# Altium project Merge Board.PrjPCB
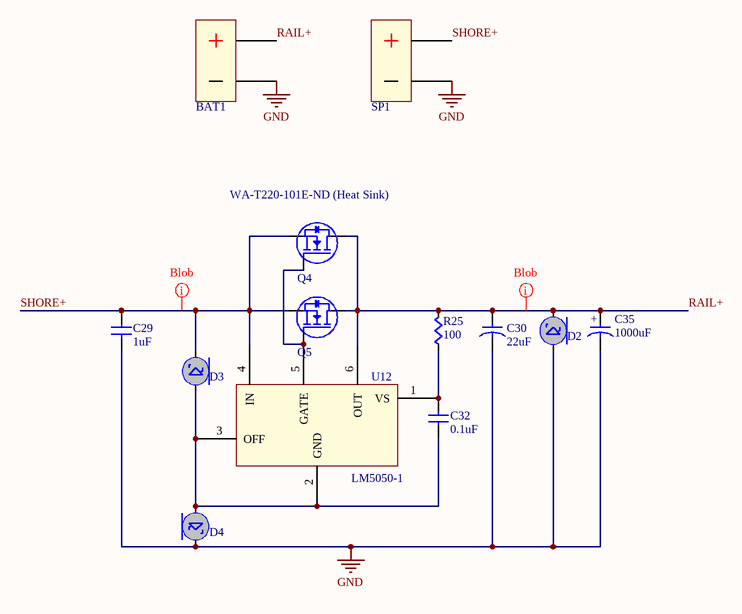
[diagram p0: Rail Station.SchDoc]
5 sheets, 115 parts. Net scope: global (net labels, ports and power ports of the same name join across sheets).
Board files: MergeBoard.PcbDoc, MergeBoard2.PcbDoc, MergeBoard3.PcbDoc, MergeBoard4.PcbDoc
Sheets:
  Rail Station.SchDoc
  PowerSplitter.SchDoc
  Power.SchDoc
  Attachments.SchDoc
  CPU.SchDoc

## Sheet Rail Station.SchDoc
size A

### Parts
BAT1  BATWIRE  [BATWIRE12]  (value not drawn)
C29  value 1uF  [CAPC0603]  (hidden comment: Cap)
C30  value 22uF  [CAP22uF100V]  (hidden comment: CapPol)
C32  value 0.1uF  [CAPC0603]  (hidden comment: Cap)
C35  value 1000uF  [CAP1000uF]  (hidden comment: CapPol)
D2  SMBJ60A-13-F  [SMBJ60A-13-F]  (value not drawn)
D3  SS16T3G  [SS16T3G]  (value not drawn)
D4  SS16T3G  [SS16T3G]  (value not drawn)
Q4  IRFB3306PbF  [TO-220AB Heatsink Vertical]  (value not drawn)
Q5  IRFB3306PbF  [TO-220AB Heatsink Vertical]  (value not drawn)
R25  value 100  [RES0603]  (hidden comment: Res)
SP1  BATWIRE  [BATWIRE12]  (value not drawn)
U12  LM5050-1  [LM5050]

### Nets
GND: BAT1.- C29.2(B) C30.2(B) C35.2(B) D2.A D4.C SP1.-
RAIL+: BAT1.+ C30.1(A) C35.1(A) D2.C Q4.D Q5.D R25.1(A) U12.6(OUT)
SHORE+: C29.1(A) D3.C Q4.S Q5.S SP1.+ U12.4(IN)
NetC32_1: C32.1(A) R25.2(B) U12.1(VS)
NetC32_2: C32.2(B) D3.A D4.A U12.2(GND) U12.3(OFF)
NetQ4_G: Q4.G Q5.G U12.5(GATE)

### Layout directives
net class Blob: RAIL+, SHORE+

### Notes on the sheet
- (near Q4) WA-T220-101E-ND (Heat Sink)
- (in symbol CapPol) +

### Library data of the parts
BAT1 SP1 = BATWIRE: Two large gauge leads soldered directly to the board.
D2 = SMBJ60A-13-F: TVS UNIDIRECT 600W 60V SMB; Supplier 1: Digi-Key; Supplier Part Number 1: SMBJ60A-FDIDKR-ND
D3 D4 = SS16T3G: DIODE SCHOTTKY 60V 1A SMA; Supplier 1: Digi-Key; Supplier Part Number 1: SS16T3GOSDKR-ND
Q4 Q5 = IRFx3306PbF: HEXFET Power MOSFET; Heatsink: A10755-ND; Supplier 1: Digi-Key; Supplier Part Number 1: IRFB3306PBF-ND
U12 = LM5050: High-Side OR-ing FET Controller; Supplier 1: Digi-Key; Supplier Part Number 1: LM5050MK-1/NOPBCT-ND
C29 C32 = Cap: Supplier 1: Digi-Key
  C29: Supplier Part Number 1: 1276-1860-1-ND
  C32: Supplier Part Number 1: 445-6938-1-ND
C30 C35 = CapPol: Supplier 1: Digi-Key
  C30: Supplier Part Number 1: P5310-ND
  C35: Supplier Part Number 1: 565-1618-ND
R25 = Res: Supplier 1: Digi-Key; Supplier Part Number 1: RMCF0603FT100RCT-ND

## Sheet PowerSplitter.SchDoc
size A
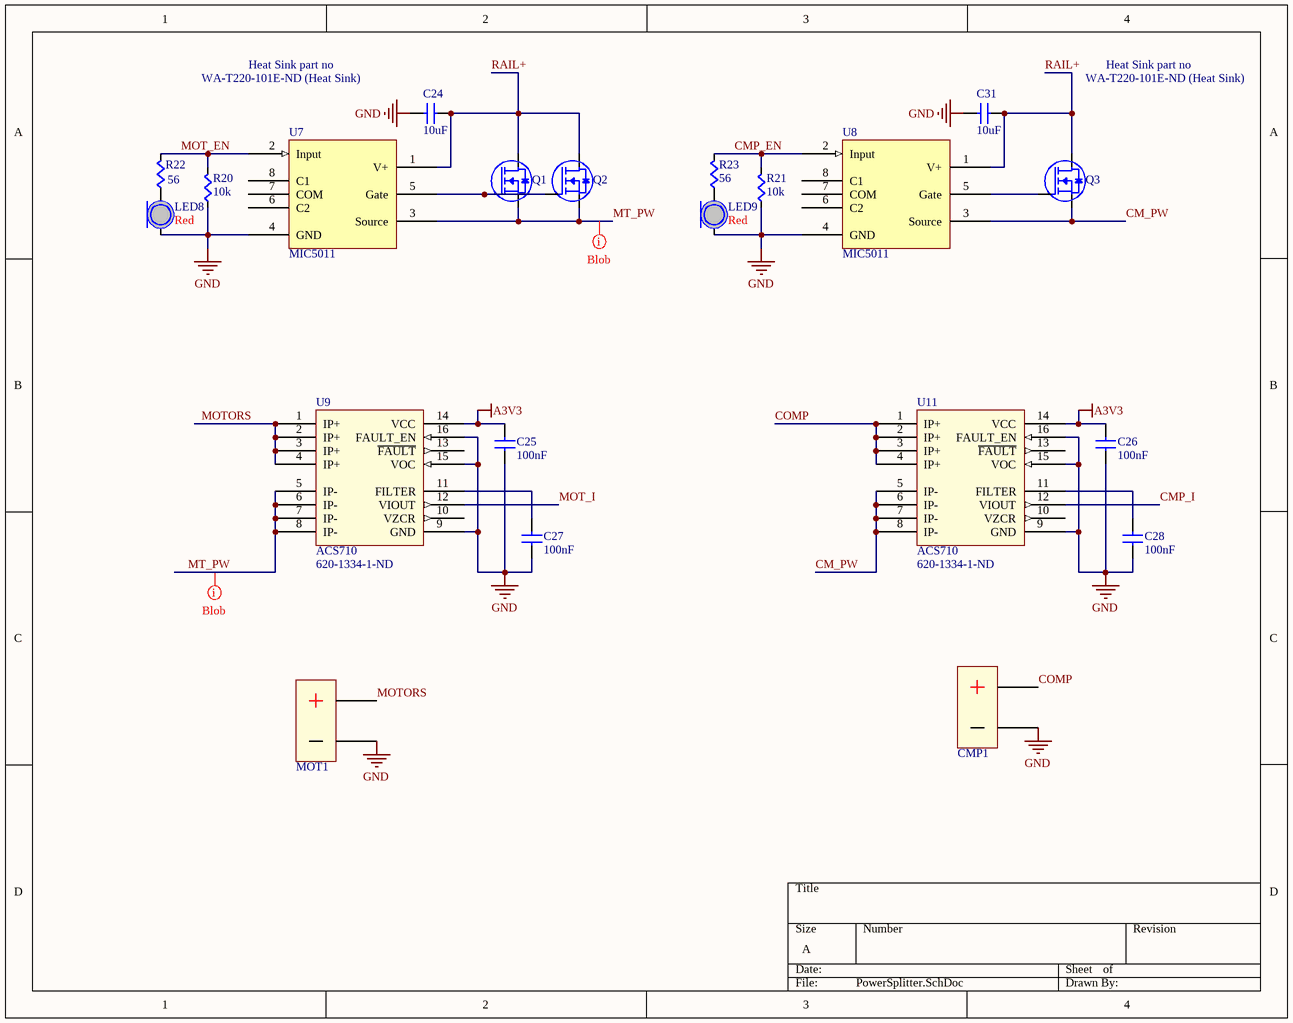
[diagram p1: PowerSplitter.SchDoc]

### Parts
C24  value 10uF  [CAPC1206]  (hidden comment: Cap)
C25  value 100nF  [CAPC0603]  (hidden comment: Cap)
C26  value 100nF  [CAPC0603]  (hidden comment: Cap)
C27  value 100nF  [CAPC0603]  (hidden comment: Cap)
C28  value 100nF  [CAPC0603]  (hidden comment: Cap)
C31  value 10uF  [CAPC1206]  (hidden comment: Cap)
CMP1  BATWIRE  [BATWIRE12]  (value not drawn)
LED8  Color: Red  [LED0805]  (hidden comment: LED)
LED9  Color: Red  [LED0805]  (hidden comment: LED)
MOT1  BATWIRE  [BATWIRE12]  (value not drawn)
Q1  IRFB3306PbF  [TO-220AB Heatsink Vertical]  (value not drawn)
Q2  IRFB3306PbF  [TO-220AB Heatsink Vertical]  (value not drawn)
Q3  IRFB3306PbF  [TO-220AB Heatsink Vertical]  (value not drawn)
R20  value 10k  [RES0603]  (hidden comment: Res)
R21  value 10k  [RES0603]  (hidden comment: Res)
R22  value 56  [RES0603]  (hidden comment: Res)
R23  value 56  [RES0603]  (hidden comment: Res)
U7  MIC5011  [MIC5011]
U8  MIC5011  [MIC5011]
U9  ACS710  Supplier Part Number 1: 620-1334-1-ND  [ACS710]
U11  ACS710  Supplier Part Number 1: 620-1334-1-ND  [ACS710]

### Nets
A3V3: C25.1(A) C26.1(A) U9.14(VCC) U11.14(VCC)
GND: C24.1(A) C25.2(B) C26.2(B) C27.2(B) C28.2(B) C31.1(A) CMP1.- LED8.C LED9.C MOT1.- R20.2(B) R21.2(B) U7.4(GND) U8.4(GND) U9.9(GND) U9.15(VOC) U9.16(FAULT_EN) U11.9(GND) U11.15(VOC) U11.16(FAULT_EN)
CM_PW: Q3.S U8.3(Source) U11.5(IP-) U11.6(IP-) U11.7(IP-) U11.8(IP-)
CMP_EN: R21.1(A) R23.1(A) U8.2(Input)
CMP_I: U11.12(VIOUT)
COMP: CMP1.+ U11.1(IP+) U11.2(IP+) U11.3(IP+) U11.4(IP+)
MOT_EN: R20.1(A) R22.1(A) U7.2(Input)
MOT_I: U9.12(VIOUT)
MOTORS: MOT1.+ U9.1(IP+) U9.2(IP+) U9.3(IP+) U9.4(IP+)
MT_PW: Q1.S Q2.S U7.3(Source) U9.5(IP-) U9.6(IP-) U9.7(IP-) U9.8(IP-)
RAIL+: C24.2(B) C31.2(B) Q1.D Q2.D Q3.D U7.1(V+) U8.1(V+)
NetC27_1: C27.1(A) U9.11(FILTER)
NetC28_1: C28.1(A) U11.11(FILTER)
NetLED8_A: LED8.A R22.2(B)
NetLED9_A: LED9.A R23.2(B)
NetQ1_G: Q1.G Q2.G U7.5(Gate)
NetQ3_G: Q3.G U8.5(Gate)

Not connected (* = marked no-connect by the designer): U7 6(C2) 7(COM) 8(C1); U8 6(C2) 7(COM) 8(C1); U9 10(VZCR) 13(~{FAULT}); U11 10(VZCR) 13(~{FAULT})

### Layout directives
net class Blob: MT_PW

### Notes on the sheet
- WA-T220-101E-ND (Heat Sink)
- Heat Sink part no

### Library data of the parts
CMP1 MOT1 = BATWIRE: as BAT1 on sheet Rail Station
Q1-Q3 = IRFx3306PbF: HEXFET Power MOSFET; Heatsink: A10755-ND; Supplier 1: Digi-Key; Supplier Part Number 1: IRFB3306PBF-ND
U7 U8 = MIC5011: Minimum Parts High- or Low-Side MOSFET Driver; Supplier 1: Digi-Key; Supplier Part Number 1: 576-1230-ND
U9 U11 = ACS710: Current Sensor with Integrated Overcurrent Detection; Supplier 1: Digi-Key
C24-C28 C31 = Cap: Supplier 1: Digi-Key
  C24 C31: Supplier Part Number 1: 1276-2876-1-ND
  C25-C28: Supplier Part Number 1: 1276-1000-1-ND
LED8 LED9 = LED: Supplier 1: Digi-Key; Supplier Part Number 1: 754-1133-1-ND
R20-R23 = Res: Supplier 1: Digi-Key
  R20 R21: Supplier Part Number 1: RMCF0603JT10K0CT-ND
  R22 R23: Supplier Part Number 1: RMCF0603JT56R0CT-ND

## Sheet Power.SchDoc
size A
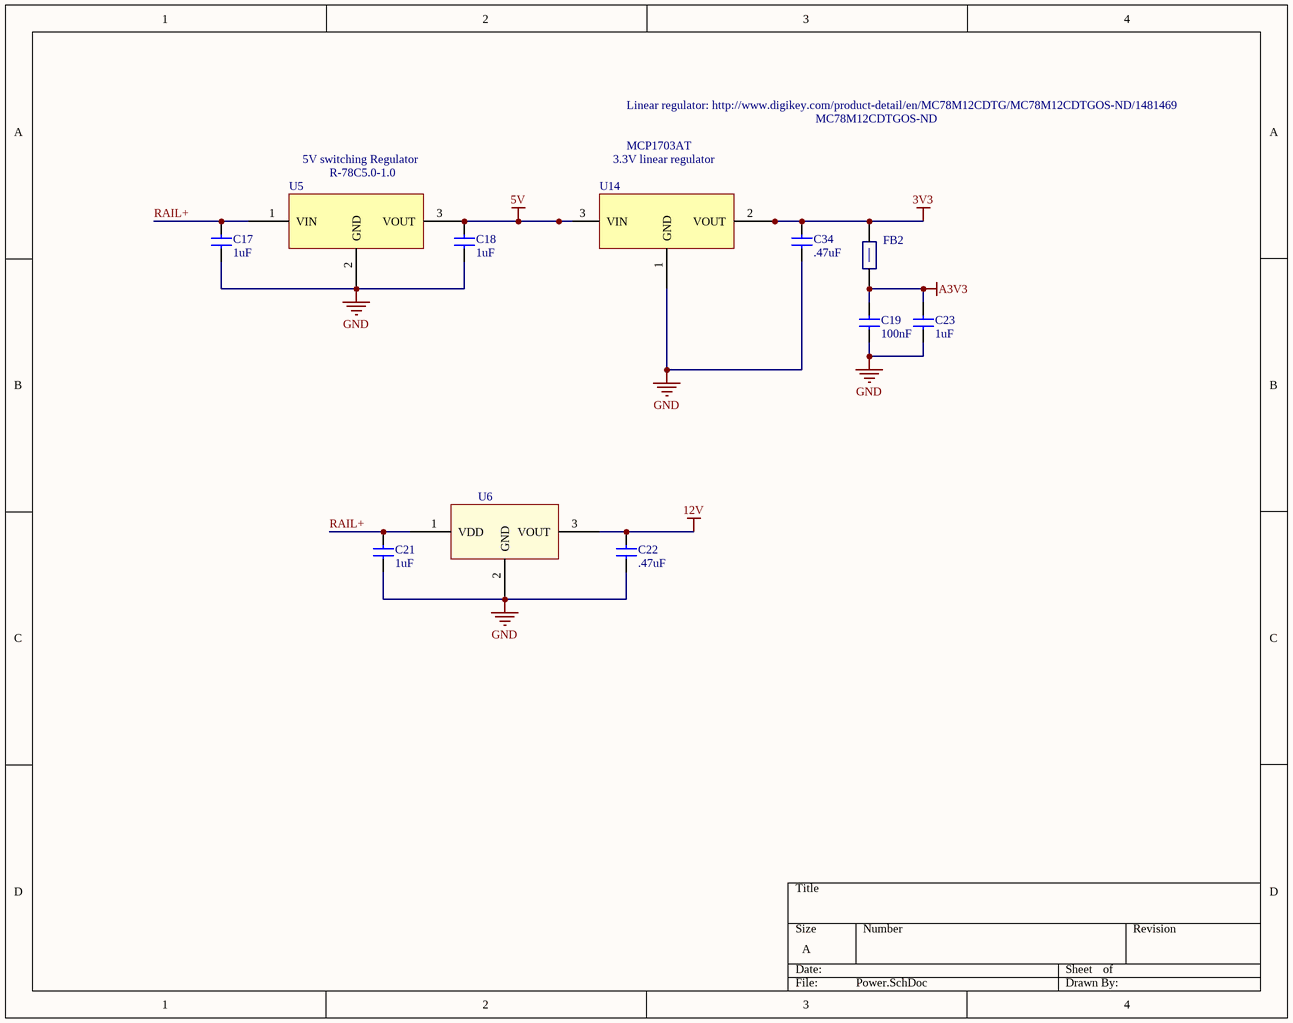
[diagram p2: Power.SchDoc]

### Parts
C17  value 1uF  [CAPC0603]  (hidden comment: Cap)
C18  value 1uF  [CAPC0603]  (hidden comment: Cap)
C19  value 100nF  [CAPC0603]  (hidden comment: Cap)
C21  value 1uF  [CAPC0603]  (hidden comment: Cap)
C22  value .47uF  [CAPC0603]  (hidden comment: Cap)
C23  value 1uF  [CAPC0603]  (hidden comment: Cap)
C34  value .47uF  [CAPC0603]  (hidden comment: Cap)
FB2  FBead  [RES0603]  (value not drawn)
U5  R-78C5.0-1.0  [R-78C5.0-1.0]
U6  MC78M12CDTG  [MC78M12CDTG]  (value not drawn)
U14  MCP1703AT  [MCP1703AT-xx02EMB]

### Nets
3V3: C34.1(A) FB2.2(B) U14.2(VOUT)
5V: C18.1(A) U5.3(VOUT) U14.3(VIN)
12V: C22.1(A) U6.3(VOUT)
A3V3: C19.1(A) C23.1(A) FB2.1(A)
GND: C17.2(B) C18.2(B) C19.2(B) C21.2(B) C22.2(B) C23.2(B) C34.2(B) U5.2(GND) U6.2(GND) U14.1(GND)
RAIL+: C17.1(A) C21.1(A) U5.1(VIN) U6.1(VDD)

### Notes on the sheet
- 5V switching Regulator
- 3.3V linear regulator
- Linear regulator: http://www.digikey.com/product-detail/en/MC78M12CDTG/MC78M12CDTGOS-ND/1481469
- MC78M12CDTGOS-ND

### Library data of the parts
FB2 = FBead: Ferrite Bead; Supplier 1: Digi-Key; Supplier Part Number 1: 445-2988-1-ND
U5 = R-78C5.0-1.0: CONV DC/DC 1A 5V OUT SIP VERT; Supplier 1: Digi-Key; Supplier Part Number 1: 945-1395-5-ND
U6 = MC78M12CDTG: IC REG LDO 12V 0.5A DPAK; Supplier 1: Digi-Key; Supplier Part Number 1: MC78M12CDTGOS-ND
U14 = MCP1703AT: 250 mA, 16V, Low Quiescent Current LDO Regulator; pin to pad: 2>3 3>2; Supplier 1: Digi-Key; Supplier Part Number 1: MCP1703AT-3302E/CBCT-ND
C17-C19 C21-C23 C34 = Cap: Supplier 1: Digi-Key
  C17 C18 C21 C23: Supplier Part Number 1: 1276-1860-1-ND
  C19: Supplier Part Number 1: 1276-1000-1-ND
  C22 C34: Supplier Part Number 1: 445-7465-1-ND

## Sheet Attachments.SchDoc
size A
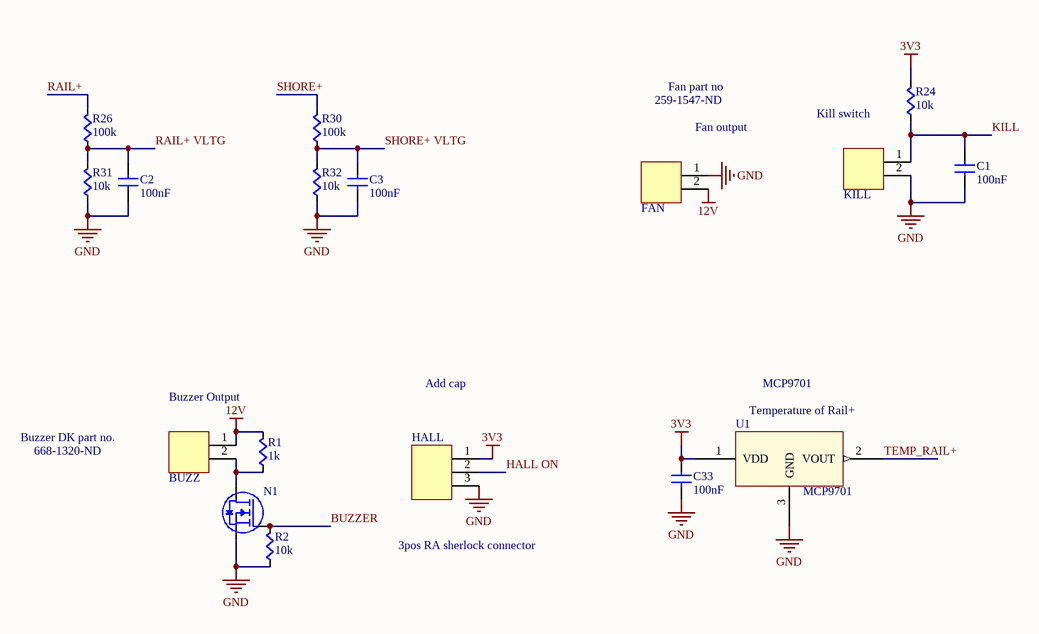
[diagram p3: Attachments.SchDoc]

### Parts
BUZZ  2-pin Horz Sherlock  [MOLEX-HDR-1X2-SHERLOCK-HORZ]  (value not drawn)
C1  value 100nF  [CAPC0603]  (hidden comment: Cap)
C2  value 100nF  [CAPC0603]  (hidden comment: Cap)
C3  value 100nF  [CAPC0603]  (hidden comment: Cap)
C33  value 100nF  [CAPC0603]  (hidden comment: Cap)
FAN  2-pin Horz Sherlock  [MOLEX-HDR-1X2-SHERLOCK-HORZ]  (value not drawn)
HALL  3pos RA sherlock connector  [MOLEX-HDR-1X3-SHERLOCK-RA]
KILL  2-pin Horz Sherlock  [MOLEX-HDR-1X2-SHERLOCK-HORZ]  (value not drawn)
N1  NMOSFET  [2N7002P,215]  (value not drawn)
R1  value 1k  [RES0603]  (hidden comment: Res)
R2  value 10k  [RES0603]  (hidden comment: Res)
R24  value 10k  [RES0603]  (hidden comment: Res)
R26  value 100k  [RES0603]  (hidden comment: Res)
R30  value 100k  [RES0603]  (hidden comment: Res)
R31  value 10k  [RES0603]  (hidden comment: Res)
R32  value 10k  [RES0603]  (hidden comment: Res)
U1  MCP9701  [MCP970X-E/TT]

### Nets
3V3: C33.2(B) HALL.1 R24.1(A) U1.1(VDD)
12V: BUZZ.1 FAN.2 R1.1(A)
GND: C1.2(B) C2.2(B) C3.2(B) C33.1(A) FAN.1 HALL.3 KILL.2 N1.2(S) R2.2(B) R31.2(B) R32.2(B) U1.3(GND)
BUZZER: N1.1(G) R2.1(A)
HALL ON: HALL.2
KILL: C1.1(A) KILL.1 R24.2(B)
RAIL+: R26.1(A)
RAIL+ VLTG: C2.1(A) R26.2(B) R31.1(A)
SHORE+: R30.1(A)
SHORE+ VLTG: C3.1(A) R30.2(B) R32.1(A)
TEMP_RAIL+: U1.2(VOUT)
NetBUZZ_2: BUZZ.2 N1.3(D) R1.2(B)

### Notes on the sheet
- Fan part no
- 259-1547-ND
- (near FAN) Fan output
- Kill switch
- Buzzer Output
- Add cap
- (near U1) Temperature of Rail+
- MCP9701
- Buzzer DK part no.
- 668-1320-ND

### Library data of the parts
BUZZ FAN KILL = MOLEX-HDR-1x2-SHERLOCK_RA: Header, Molex, 2mm Pitch Sherlock Header, Single Row, Horizontal, 2 Circuits, Length 3.3mm,  0353630260; Manufacturer: Molex Inc; Manufacturer Part Number: 0353630260; Supplier Part Number: WM18931-ND; Supplier: Digi-Key
HALL = MOLEX-HDR-1x3-SHERLOCK_RA: Header, Molex, 2mm Pitch Sherlock Header, Single Row, Right Angle 3 Circuits, Length 3.3mm; Manufacturer Part Number: 35363-0360; Manufacturer: Molex Connector Corporation; Supplier Part Number: WM18932-ND; Supplier: Digi-Key
N1 = NMOSFET: NMOSFET Template; Supplier 1: Digi-Key; Supplier Part Number 1: 568-5818-1-ND
U1 = MCP970x: Low-Power Linear Active Thermistor ICs; Supplier 1: Digi-Key; Supplier Part Number 1: MCP9701AT-E/TTCT-ND
C1-C3 C33 = Cap: Supplier 1: Digi-Key; Supplier Part Number 1: 1276-1000-1-ND
R1 R2 R24 R26 R30-R32 = Res: Supplier 1: Digi-Key
  R1: Supplier Part Number 1: RMCF0603JT1K00CT-ND
  R2 R24: Supplier Part Number 1: RMCF0603JT10K0CT-ND
  R26 R30: Supplier Part Number 1: RR08P100KDCT-ND
  R31 R32: Supplier Part Number 1: RR08P10.0KDCT-ND

## Sheet CPU.SchDoc
size A4
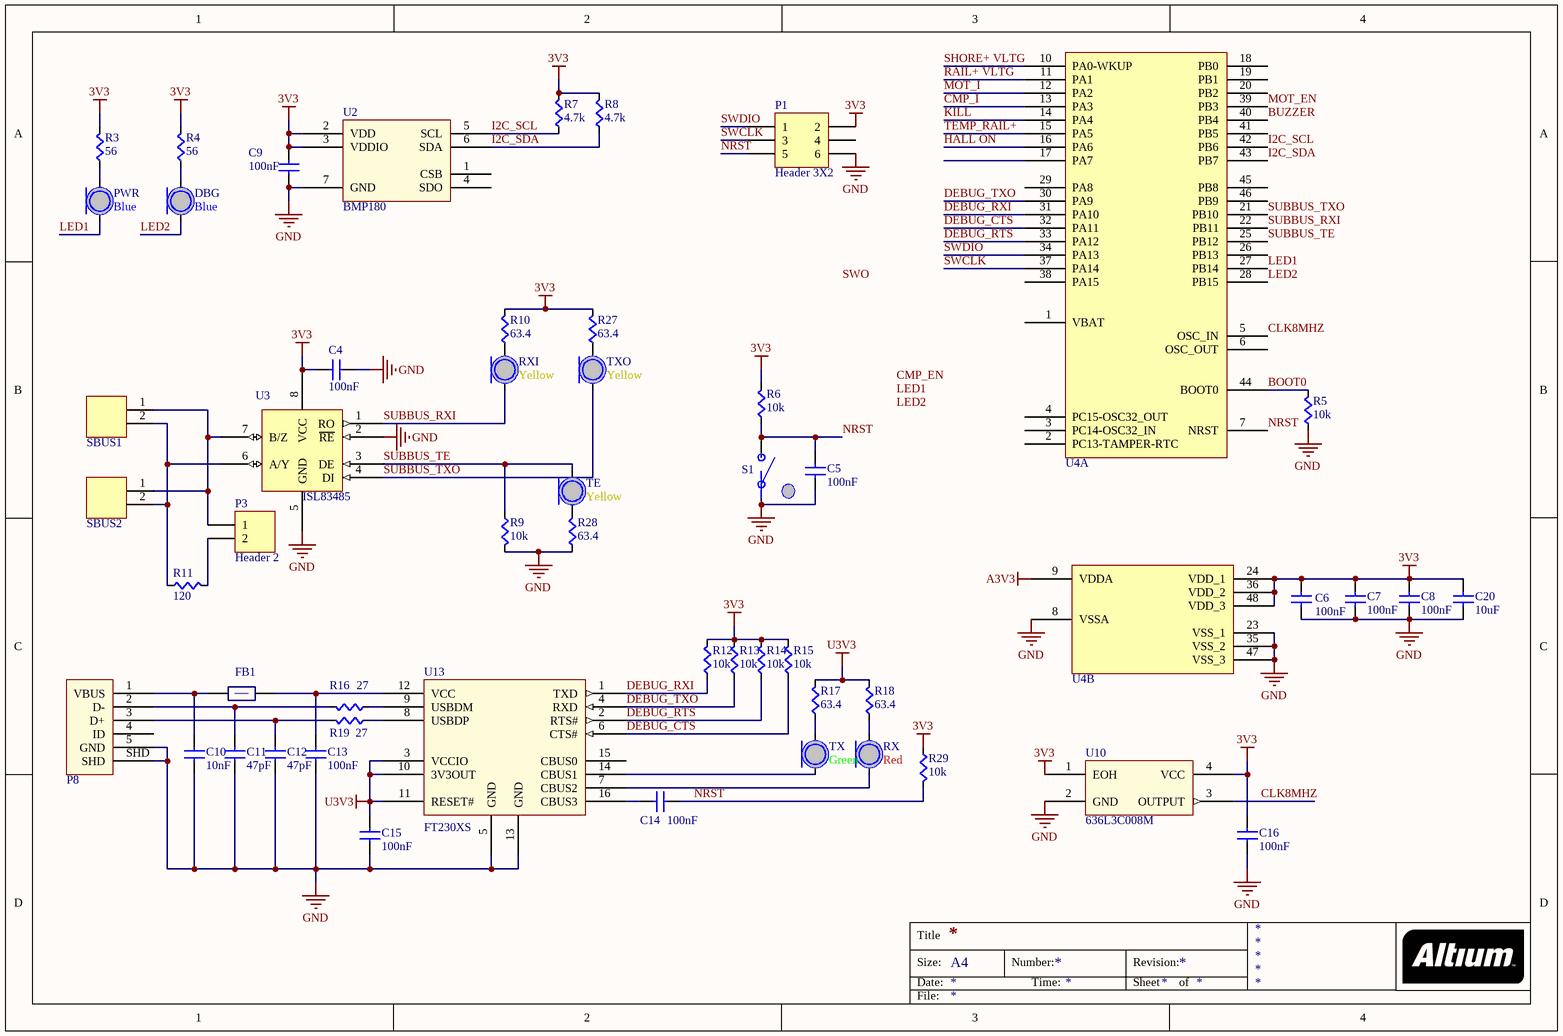
[diagram p4: CPU.SchDoc]

### Parts
C4  value 100nF  [CAPC0603]  (hidden comment: Cap)
C5  value 100nF  [CAPC0603]  (hidden comment: Cap)
C6  value 100nF  [CAPC0603]  (hidden comment: Cap)
C7  value 100nF  [CAPC0603]  (hidden comment: Cap)
C8  value 100nF  [CAPC0603]  (hidden comment: Cap)
C9  value 100nF  [CAPC0603]  (hidden comment: Cap)
C10  value 10nF  [CAPC0603]  (hidden comment: Cap)
C11  value 47pF  [CAPC0603]  (hidden comment: Cap)
C12  value 47pF  [CAPC0603]  (hidden comment: Cap)
C13  value 100nF  [CAPC0603]  (hidden comment: Cap)
C14  value 100nF  [CAPC0603]  (hidden comment: Cap)
C15  value 100nF  [CAPC0603]  (hidden comment: Cap)
C16  value 100nF  [CAPC0603]  (hidden comment: Cap)
C20  value 10uF  [CAPC1206]  (hidden comment: Cap)
DBG  Color: Blue  [LED0805]  (hidden comment: LED)
FB1  FBead  [RES0603]  (value not drawn)
P1  Header 3X2  [HDR2X3]
P3  Header 2  [HDR1X2]
P8  UX60SC-MB-5ST  [UX60SC-MB-5ST]  (value not drawn)
PWR  Color: Blue  [LED0805]  (hidden comment: LED)
R3  value 56  [RES0603]  (hidden comment: Res)
R4  value 56  [RES0603]  (hidden comment: Res)
R5  value 10k  [RES0603]  (hidden comment: Res)
R6  value 10k  [RES0603]  (hidden comment: Res)
R7  value 4.7k  [RES0603]  (hidden comment: Res)
R8  value 4.7k  [RES0603]  (hidden comment: Res)
R9  value 10k  [RES0603]  (hidden comment: Res)
R10  value 63.4  [RES0603]  (hidden comment: Res)
R11  value 120  [RES0603]  (hidden comment: Res)
R12  value 10k  [RES0603]  (hidden comment: Res)
R13  value 10k  [RES0603]  (hidden comment: Res)
R14  value 10k  [RES0603]  (hidden comment: Res)
R15  value 10k  [RES0603]  (hidden comment: Res)
R16  value 27  [RES0603]  (hidden comment: Res)
R17  value 63.4  [RES0603]  (hidden comment: Res)
R18  value 63.4  [RES0603]  (hidden comment: Res)
R19  value 27  [RES0603]  (hidden comment: Res)
R27  value 63.4  [RES0603]  (hidden comment: Res)
R28  value 63.4  [RES0603]  (hidden comment: Res)
R29  value 10k  [RES0603]  (hidden comment: Res)
RX  Color: Red  [LED0805]  (hidden comment: LED)
RXI  Color: Yellow  [LED0805]  (hidden comment: LED)
S1  Button  [PTS645xxxxSMTR92]  (value not drawn)
SBUS1  2-pin Horz Sherlock  [MOLEX-HDR-1X2-SHERLOCK-HORZ]  (value not drawn)
SBUS2  2-pin Horz Sherlock  [MOLEX-HDR-1X2-SHERLOCK-HORZ]  (value not drawn)
TE  Color: Yellow  [LED0805]  (hidden comment: LED)
TX  Color: Green  [LED0805]  (hidden comment: LED)
TXO  Color: Yellow  [LED0805]  (hidden comment: LED)
U2  BMP180  [BMP180]
U3  ISL83485  [ISL8348xIBZ]
U4  STM32F103C8T7  [STM32F103C8T7]  (value not drawn)  (parts A,B of 2)
U10  636L3C008M  [636L3C]
U13  FT230XS  [FT230XS]

### Nets
3V3: C4.2(B) C6.1(A) C7.1(A) C8.1(A) C9.1(A) C16.1(A) C20.2(B) P1.2 R3.1(A) R4.1(A) R6.1(A) R7.1(A) R8.1(A) R10.1(A) R12.1(A) R13.1(A) R14.1(A) R15.1(A) R27.1(A) R29.1(A) U2.2(VDD) U2.3(VDDIO) U3.8(VCC) U4.24(VDD_1) U4.36(VDD_2) U4.48(VDD_3) U10.1(EOH) U10.4(VCC)
A3V3: U4.9(VDDA)
GND: C4.1(A) C5.2(B) C6.2(B) C7.2(B) C8.2(B) C9.2(B) C10.2(B) C11.2(B) C12.2(B) C13.2(B) C15.2(B) C16.2(B) C20.1(A) P1.6 P8.5(GND) P8.SHD R5.2(B) R9.2(B) R28.2(B) S1.A U2.7(GND) U3.2(~{RE}) U3.5(GND) U4.8(VSSA) U4.23(VSS_1) U4.35(VSS_2) U4.47(VSS_3) U10.2(GND) U13.5(GND) U13.13(GND)
U3V3: C15.1(A) R17.1(A) R18.1(A) U13.3(VCCIO) U13.10(3V3OUT) U13.11(RESET#)
BOOT0: R5.1(A) U4.44(BOOT0)
BUZZER: U4.40(PB4)
CLK8MHZ: U4.5(OSC_IN) U10.3(OUTPUT)
CMP_I: U4.13(PA3)
DEBUG_CTS: R15.2(B) U4.32(PA11) U13.6(CTS#)
DEBUG_RTS: R14.2(B) U4.33(PA12) U13.2(RTS#)
DEBUG_RXI: R12.2(B) U4.31(PA10) U13.1(TXD)
DEBUG_TXO: R13.2(B) U4.30(PA9) U13.4(RXD)
HALL ON: U4.16(PA6)
I2C_SCL: R7.2(B) U2.5(SCL) U4.42(PB6)
I2C_SDA: R8.2(B) U2.6(SDA) U4.43(PB7)
KILL: U4.14(PA4)
LED1: PWR.C U4.27(PB14)
LED2: DBG.C U4.28(PB15)
MOT_EN: U4.39(PB3)
MOT_I: U4.12(PA2)
NRST: C5.1(A) C14.2(B) P1.5 R6.2(B) R29.2(B) S1.B U4.7(NRST)
RAIL+ VLTG: U4.11(PA1)
SHORE+ VLTG: U4.10(PA0-WKUP)
SUBBUS_RXI: RXI.C U3.1(RO) U4.22(PB11)
SUBBUS_TE: R9.1(A) TE.A U3.3(DE) U4.25(PB12)
SUBBUS_TXO: TXO.C U3.4(DI) U4.21(PB10)
SWCLK: P1.3 U4.37(PA14)
SWDIO: P1.1 U4.34(PA13)
TEMP_RAIL+: U4.15(PA5)
NetC10_1: C10.1(A) FB1.2(B) P8.1(VBUS)
NetC11_1: C11.1(A) P8.2(D-) R16.1(A)
NetC12_1: C12.1(A) P8.3(D+) R19.1(A)
NetC13_1: C13.1(A) FB1.1(A) U13.12(VCC)
NetC14_1: C14.1(A) U13.16(CBUS3)
NetDBG_A: DBG.A R4.2(B)
NetP3_1: P3.1 SBUS1.1 SBUS2.1 U3.7(B/Z)
NetP3_2: P3.2 R11.1(A)
NetPWR_A: PWR.A R3.2(B)
NetR10_2: R10.2(B) RXI.A
NetR11_2: R11.2(B) SBUS1.2 SBUS2.2 U3.6(A/Y)
NetR16_2: R16.2(B) U13.9(USBDM)
NetR17_2: R17.2(B) TX.A
NetR18_2: R18.2(B) RX.A
NetR19_2: R19.2(B) U13.8(USBDP)
NetR27_2: R27.2(B) TXO.A
NetR28_1: R28.1(A) TE.C
NetRX_C: RX.C U13.7(CBUS2)
NetTX_C: TX.C U13.14(CBUS1)

Not connected (* = marked no-connect by the designer): P1 4; P8 4(ID); U2 1(CSB) 4(SDO); U4 1(VBAT) 2(PC13-TAMPER-RTC) 3(PC14-OSC32_IN) 4(PC15-OSC32_OUT) 6(OSC_OUT) 17(PA7) 18(PB0) 19(PB1) 20(PB2) 26(PB13) 29(PA8) 38(PA15) 41(PB5) 45(PB8) 46(PB9); U13 15(CBUS0)

### Notes on the sheet
- Labels drawn without touching a wire or pin: CMP_EN, LED1, LED2, SWO
- Title
- Size:
- Date:
- A4
- Number:
- Time:
- Revision:
- Sheet
- of
- File:

### Library data of the parts
FB1 = FBead: Ferrite Bead; Supplier 1: Digi-Key; Supplier Part Number 1: 445-2988-1-ND
P1 = Header 3X2: Header, 3-Pin, Dual row; LatestRevisionDate: 17-Jul-2002; LatestRevisionNote: Re-released for DXP Platform.; Publisher: Altium Limited
P3 = Header 2: Header, 2-Pin; LatestRevisionDate: 17-Jul-2002; LatestRevisionNote: Re-released for DXP Platform.; Publisher: Altium Limited
P8 = UX60SC-MB-5ST: USB Mini B Metal Shield SMT; Supplier 1: Digi-Key; Supplier Part Number 1: H11671CT-ND
S1 = Button: SPST Button; Supplier 1: Digi-Key; Supplier Part Number 1: CKN9087CT-ND
SBUS1 SBUS2 = MOLEX-HDR-1x2-SHERLOCK_RA: as BUZZ on sheet Attachments; Manufacturer Part Number: 0353630260; Supplier Part Number: WM18931-ND; Supplier: Digi-Key
U2 = BMP180: Digital Pressure Sensor; Supplier 1: Digi-Key; Supplier Part Number 1: 828-1027-1-ND
U3 = ISL83485: 3.3V RS485 Transceiver; Supplier 1: Digi-Key; Supplier Part Number 1: ISL83485IBZ-ND
U4 = STM32F103C8T7: MCU ARM 32BIT 64K FLASH 48-LQFP; Supplier 1: Digi-Key; Supplier Part Number 1: 497-11517-ND
U10 = 636L3C: HCMOS/TTL Clock Oscillator; Supplier 1: Digi-Key; Supplier Part Number 1: CTX1005CT-ND
U13 = FT230XS: USB To Basic UART IC; Supplier 1: Digi-Key; Supplier Part Number 1: 768-1154-5-ND
C4-C16 C20 = Cap: Supplier 1: Digi-Key
  C4-C9 C13-C16: Supplier Part Number 1: 1276-1000-1-ND
  C10: Supplier Part Number 1: 445-1311-1-ND
  C11 C12: Supplier Part Number 1: 445-1277-1-ND
  C20: Supplier Part Number 1: 1276-2876-1-ND
DBG PWR RX RXI TE TX TXO = LED: Supplier 1: Digi-Key
  DBG PWR: Supplier Part Number 1: 350-2046-1-ND
  RX: Supplier Part Number 1: 754-1133-1-ND
  RXI TE TXO: Supplier Part Number 1: 475-2560-1-ND
  TX: Supplier Part Number 1: 160-1887-1-ND
R3-R19 R27-R29 = Res: Supplier 1: Digi-Key
  R3 R4: Supplier Part Number 1: RMCF0603JT56R0CT-ND
  R5 R6 R9 R12-R15 R29: Supplier Part Number 1: RMCF0603JT10K0CT-ND
  R7 R8: Supplier Part Number 1: RMCF0603JT4K70CT-ND
  R10 R17 R18 R27 R28: Supplier Part Number 1: RMCF0603FT63R4CT-ND
  R11: Supplier Part Number 1: RHM120HCT-ND
  R16 R19: Supplier Part Number 1: RMCF0603JT27R0CT-ND

## Nets that join several sheets
3V3: Power (C34.1 FB2.2 U14.2), Attachments (C33.2 HALL.1 R24.1 U1.1), CPU (28 pins)
12V: Power (C22.1 U6.3), Attachments (BUZZ.1 FAN.2 R1.1)
A3V3: PowerSplitter (C25.1 C26.1 U9.14 U11.14), Power (C19.1 C23.1 FB2.1), CPU (U4.9)
GND: Rail Station (7 pins), PowerSplitter (20 pins), Power (10 pins), Attachments (12 pins), CPU (30 pins)
BUZZER: Attachments (N1.1 R2.1), CPU (U4.40)
CMP_I: PowerSplitter (U11.12), CPU (U4.13)
HALL ON: Attachments (HALL.2), CPU (U4.16)
KILL: Attachments (C1.1 KILL.1 R24.2), CPU (U4.14)
MOT_EN: PowerSplitter (R20.1 R22.1 U7.2), CPU (U4.39)
MOT_I: PowerSplitter (U9.12), CPU (U4.12)
RAIL+: Rail Station (8 pins), PowerSplitter (7 pins), Power (C17.1 C21.1 U5.1 U6.1), Attachments (R26.1)
RAIL+ VLTG: Attachments (C2.1 R26.2 R31.1), CPU (U4.11)
SHORE+: Rail Station (6 pins), Attachments (R30.1)
SHORE+ VLTG: Attachments (C3.1 R30.2 R32.1), CPU (U4.10)
TEMP_RAIL+: Attachments (U1.2), CPU (U4.15)